# EAGLE board mmt_xbee (EAGLE 9.6.2)
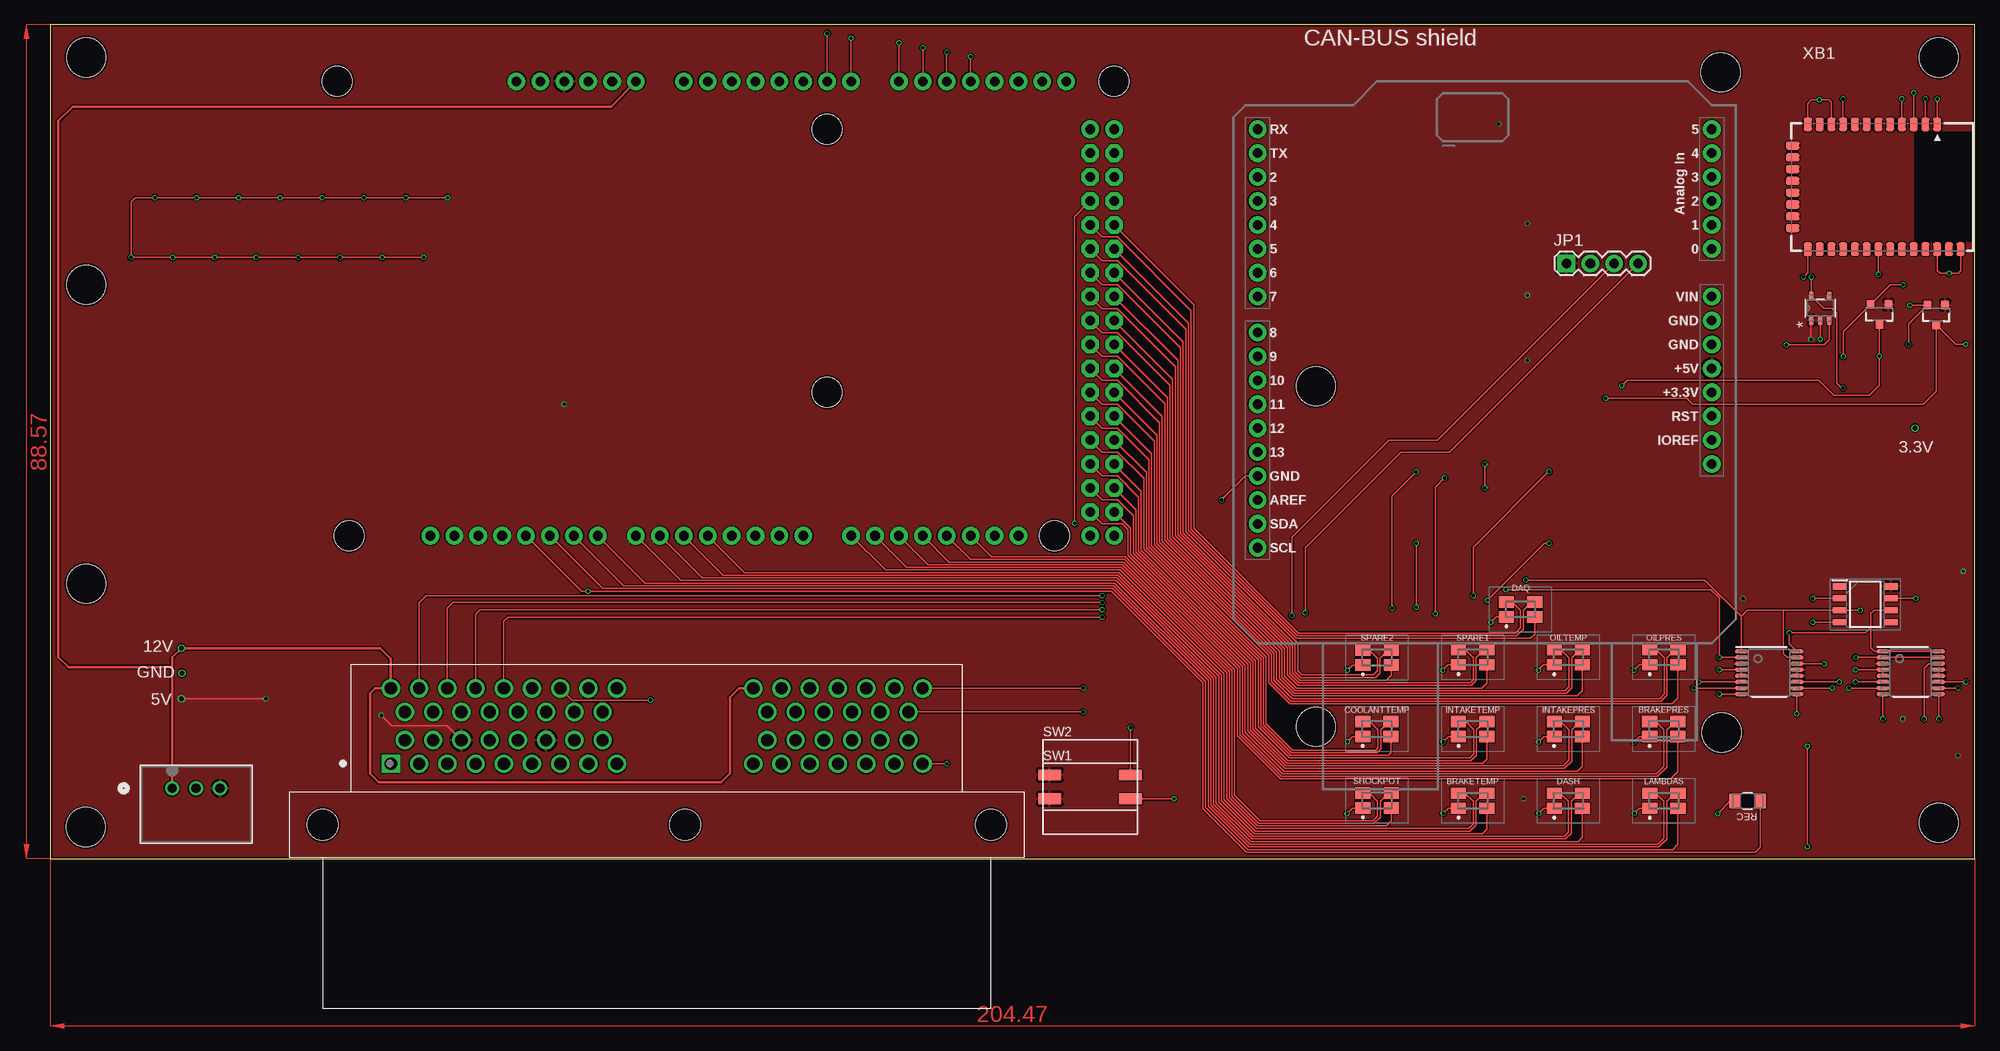
[diagram p7: board, top side]
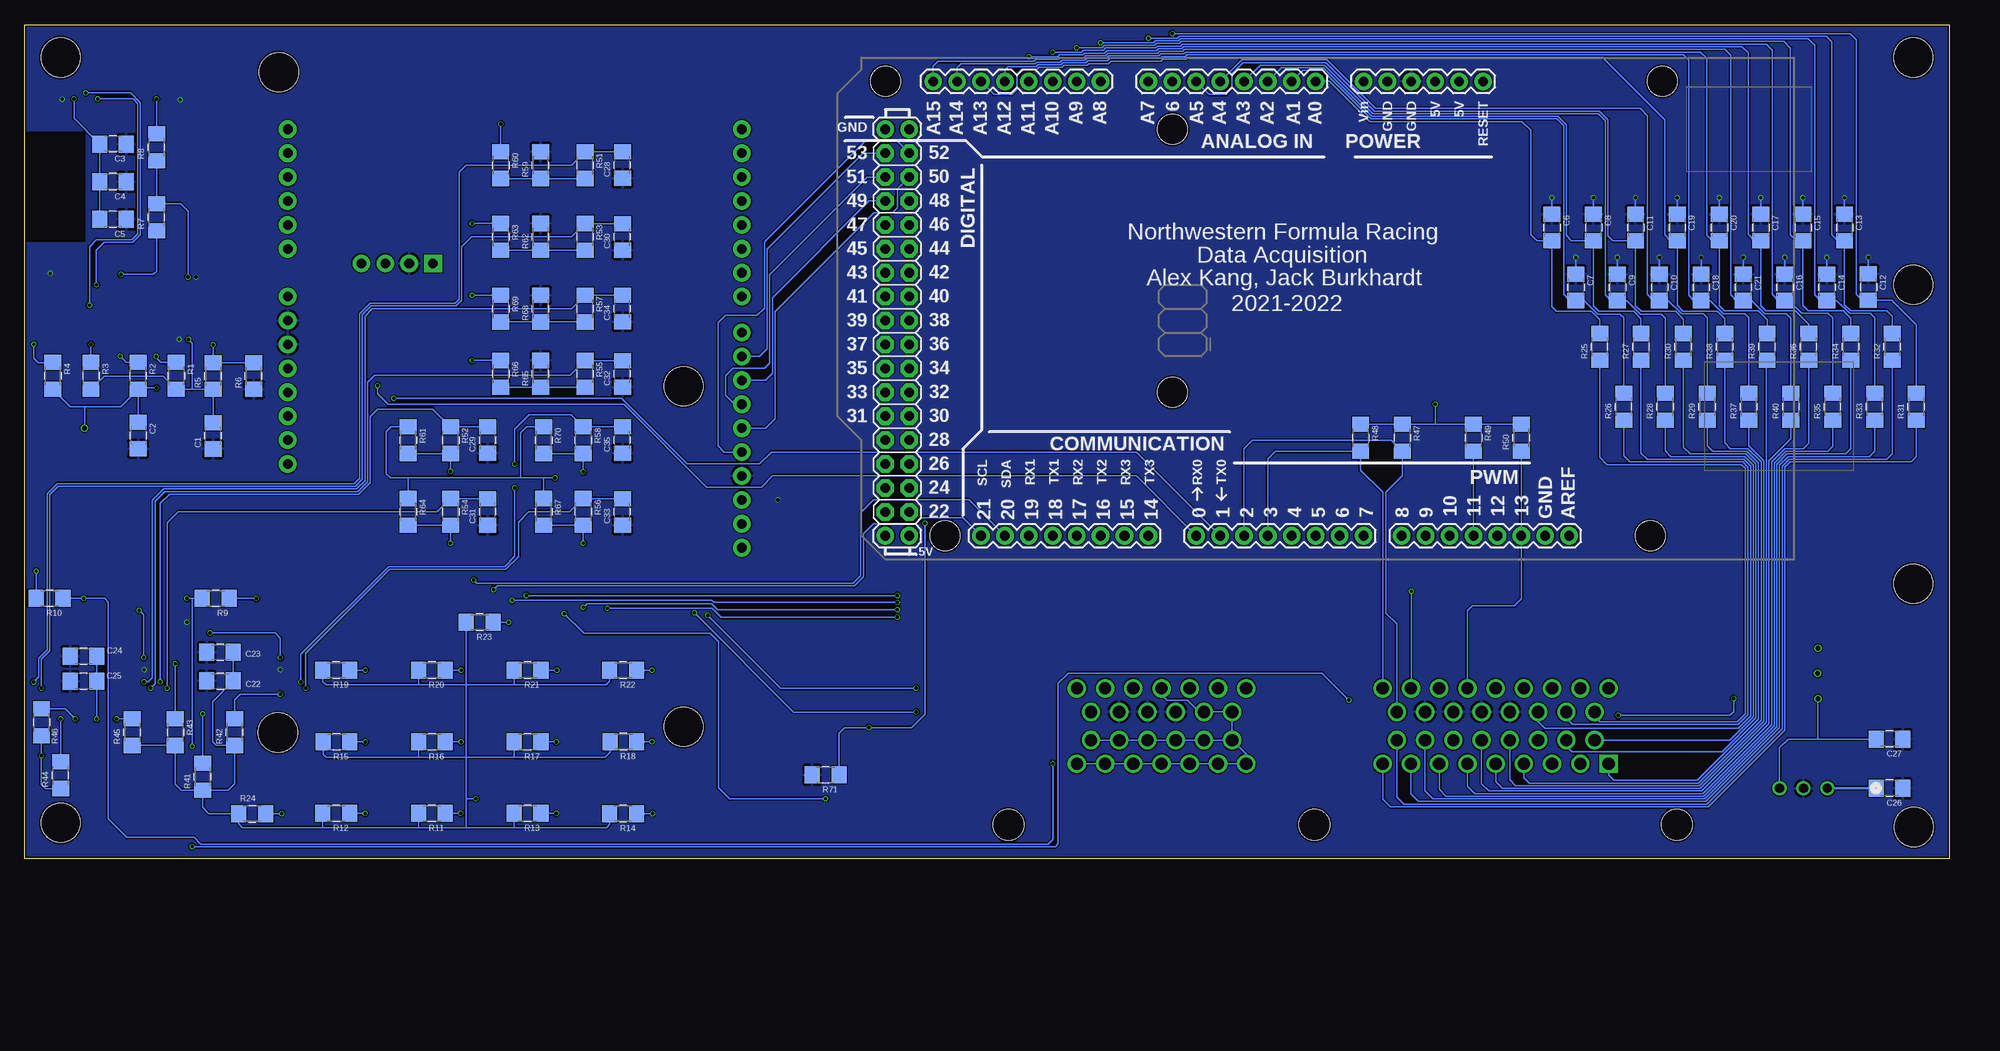
[diagram p8: board, bottom side, seen from below]

Size 204.45 x 88.57 mm. Coordinates in mm from the lower left corner, seen from the top.
Outline: 0,0 204.45,0 204.45,88.57 0,88.57 0,0
Copper layers (1*16): Top 0.035559375mm / dielectric 1.6mm / Bottom 0.035559375mm
Design rules "jlcpcb2layer": minimum track width 5mil, minimum drill 12mil, track to track 5mil, track to pad 5mil, pad to pad 5mil, via to via 5mil, smd to smd 5mil, copper to edge 8mil, drill to drill 6mil, minimum pad ring 5mil, minimum via ring 3mil, stop-mask expansion 2.5mil, vias tented up to drill 0mil, thermal gap 10mil
Holes 4.17 mm at 134.47,50.19 134.47,14.02 177.57,13.39 177.47,83.52 3.81,85.09 3.76,3.35 200.66,3.81 200.66,85.09 3.81,29.21 3.81,60.96
tRestrict: area 198.1,65.6 to 205,77.1
bRestrict: area 198.1,65.6 to 205,77.1

## Footprints (pad centres in the part's own frame; a part is rotated, then mirrored left to right if it is on the bottom)
ARDUINO_MEGA = drill 1.016 pad 1.88: 0 13.97,24.13; 1 11.43,24.13; 2 8.89,24.13; 3 6.35,24.13; 3.3V -13.97,-24.13; 4 3.81,24.13; 5 1.27,24.13; 5V@0 -11.43,-24.13; 5V@1 44.45,24.13; 5V@2 46.99,24.13; 6 -1.27,24.13; 7 -3.81,24.13; 8 -7.874,24.13; 9 -10.414,24.13; 10 -12.954,24.13; 11 -15.494,24.13; 12 -18.034,24.13; 13 -20.574,24.13; 14 19.05,24.13; 15 21.59,24.13; 16 24.13,24.13; 17 26.67,24.13; 18 29.21,24.13; 19 31.75,24.13; 20 34.29,24.13; 21 36.83,24.13; A0 1.27,-24.13; A1 3.81,-24.13; A2 6.35,-24.13; A3 8.89,-24.13; A4 11.43,-24.13; A5 13.97,-24.13; A6 16.51,-24.13; A7 19.05,-24.13; A8 24.13,-24.13; A9 26.67,-24.13; A10 29.21,-24.13; A11 31.75,-24.13; A12 34.29,-24.13; A13 36.83,-24.13; A14 39.37,-24.13; A15 41.91,-24.13; AREF -25.654,24.13; GND@0 -8.89,-24.13; GND@1 -6.35,-24.13; GND@2 44.45,-19.05; GND@3 46.99,-19.05; GND@4 -23.114,24.13; RESET -16.51,-24.13; VIN -3.81,-24.13 | drill 1.016 pad 1.88 octagon: 22 44.45,21.59; 23 46.99,21.59; 24 44.45,19.05; 25 46.99,19.05; 26 44.45,16.51; 27 46.99,16.51; 28 44.45,13.97; 29 46.99,13.97; 30 44.45,11.43; 31 46.99,11.43; 32 44.45,8.89; 33 46.99,8.89; 34 44.45,6.35; 35 46.99,6.35; 36 44.45,3.81; 37 46.99,3.81; 38 44.45,1.27; 39 46.99,1.27; 40 44.45,-1.27; 41 46.99,-1.27; 42 44.45,-3.81; 43 46.99,-3.81; 44 44.45,-6.35; 45 46.99,-6.35; 46 44.45,-8.89; 47 46.99,-8.89; 48 44.45,-11.43; 49 46.99,-11.43; 50 44.45,-13.97; 51 46.99,-13.97; 52 44.45,-16.51; 53 46.99,-16.51 | hole 3.2: -34.29,24.13; -35.56,-24.13; 16.51,8.89; 16.51,-19.05; 40.64,24.13; 46.99,-24.13
156120M173000 = smd 1.6 x 1.2: 1 -1.5,-0.8; 2 -1.5,0.8; 3 1.5,0.8; 4 1.5,-0.8
C1206 = smd 1.6 x 1.8: 1 -1.4,0; 2 1.4,0
SOIC127P600X175-8N = smd 1.525 x 0.65: 1 -2.712,1.905; 2 -2.712,0.635; 3 -2.712,-0.635; 4 -2.712,-1.905; 5 2.712,-1.905; 6 2.712,-0.635; 7 2.712,0.635; 8 2.712,1.905
TE_6473427-1 = drill 1.3 square: 1 -31.25,6.5 | drill 1.3: 2 -28.25,6.5; 3 -25.25,6.5; 4 -22.25,6.5; 5 -19.25,6.5; 6 -16.25,6.5; 7 -13.25,6.5; 8 -10.25,6.5; 9 -7.25,6.5; 10 -29.75,9; 11 -26.75,9; 12 -23.75,9; 13 -20.75,9; 14 -17.75,9; 15 -14.75,9; 16 -11.75,9; 17 -8.75,9; 18 -29.75,12; 19 -26.75,12; 20 -23.75,12; 21 -20.75,12; 22 -17.75,12; 23 -14.75,12; 24 -11.75,12; 25 -8.75,12; 26 -31.25,14.5; 27 -28.25,14.5; 28 -25.25,14.5; 29 -22.25,14.5; 30 -19.25,14.5; 31 -16.25,14.5; 32 -13.25,14.5; 33 -10.25,14.5; 34 -7.25,14.5; 35 7.25,6.5; 36 10.25,6.5; 37 13.25,6.5; 38 16.25,6.5; 39 19.25,6.5; 40 22.25,6.5; 41 25.25,6.5; 42 8.75,9; 43 11.75,9; 44 14.75,9; 45 17.75,9; 46 20.75,9; 47 23.75,9; 48 8.75,12; 49 11.75,12; 50 14.75,12; 51 17.75,12; 52 20.75,12; 53 23.75,12; 54 7.25,14.5; 55 10.25,14.5; 56 13.25,14.5; 57 16.25,14.5; 58 19.25,14.5; 59 22.25,14.5; 60 25.25,14.5 | hole 3.3: 0,0; -38.5,0; 32.5,0
CONN3_10S05_XPP = drill 0.991 pad 1.499: 1 0,0; 2 2.54,0; 3 5.08,0
1X04 = drill 1.016 pad 1.88 square: 1 0,0 | drill 1.016 pad 1.88: 2 2.54,0; 3 5.08,0; 4 7.62,0
SOT23-3 = smd 0.8 x 0.9: 1 -0.95,-1; 2 0.95,-1; 3 0,1.1
R1206 = smd 1.6 x 1.803: 1 -1.422,0; 2 1.422,0
LED_SML-LX1206SIC-TR_LUM = smd 1.168 x 1.499: 1 -1.372,0; 2 1.372,0
CTS_ELECTROCOMPONENTS_204-211ST_0 = smd 2.44 x 1.13: 1 -4.3,0; 2 4.3,0
SOT-25_TOR = smd 0.927 x 0.432: 1 -1.289,0.95; 2 -1.289,0; 3 -1.289,-0.95; 4 1.289,-0.95; 5 1.289,0.95
UNO_R3_SHIELD = drill 1.016 pad 1.88: 3.3V 50.8,26.67; 5V 50.8,29.21; A0 50.8,41.91; A1 50.8,44.45; A2 50.8,46.99; A3 50.8,49.53; A4 50.8,52.07; A5 50.8,54.61; AREF 2.54,15.24; D2 2.54,49.53; D3 2.54,46.99; D4 2.54,44.45; D5 2.54,41.91; D6 2.54,39.37; D7 2.54,36.83; D8 2.54,33.02; D9 2.54,30.48; D10 2.54,27.94; D11 2.54,25.4; D12 2.54,22.86; D13 2.54,20.32; GND@0 50.8,31.75; GND@1 50.8,34.29; GND@2 2.54,17.78; IOREF 50.8,21.59; NC 50.8,19.05; RES 50.8,24.13; RX 2.54,54.61; SCL 2.54,10.16; SDA 2.54,12.7; TX 2.54,52.07; VIN 50.8,36.83
PW0016A_N = smd 1.4 x 0.45: 1 -2.95,2.275; 2 -2.95,1.625; 3 -2.95,0.975; 4 -2.95,0.325; 5 -2.95,-0.325; 6 -2.95,-0.975; 7 -2.95,-1.625; 8 -2.95,-2.275; 9 2.95,-2.275; 10 2.95,-1.625; 11 2.95,-0.975; 12 2.95,-0.325; 13 2.95,0.325; 14 2.95,0.975; 15 2.95,1.625; 16 2.95,2.275
XBEE_MMT = smd 1.43 x 0.85: 1 0,0; 2 0,-1.25; 3 0,-2.5; 4 0,-3.75; 5 0,-5; 6 0,-6.25; 7 0,-7.5; 8 0,-8.75; 9 0,-10; 10 0,-11.25; 11 0,-12.5; 12 0,-13.75; 21 13.25,-13.75; 22 13.25,-12.5; 23 13.25,-11.25; 24 13.25,-10; 25 13.25,-8.75; 26 13.25,-7.5; 27 13.25,-6.25; 28 13.25,-5; 29 13.25,-3.75; 30 13.25,-2.5; 31 13.25,-1.25; 32 13.25,0; 33 13.25,1.25; 34 13.25,2.5 | smd 0.85 x 1.43: 13 2.25,-15.35; 14 3.5,-15.35; 15 4.75,-15.35; 16 6,-15.35; 17 7.25,-15.35; 18 8.5,-15.35; 19 9.75,-15.35; 20 11,-15.35

## Placement (x,y rotation side)
B1  ARDUINO_MEGA_R3FULL  [ARDUINO_MEGA]  66.04,58.42 180 bottom
BRAKEPRES  156120M173000  [156120M173000]  171.42,13.77 0 top
BRAKETEMP  156120M173000  [156120M173000]  151.13,6.15 0 top
C1  10μF  [C1206]  184.45,44.91 90 bottom
C2  10μF  [C1206]  192.43,44.93 270 bottom
C3  8.2pF  [C1206]  195.1,75.9 180 bottom
C4  8.2pF  [C1206]  195.1,71.88 180 bottom
C5  10μF  [C1206]  195.1,67.89 180 bottom
C6  0.1μF  [C1206]  42.21,67.03 270 bottom
C7  0.1μF  [C1206]  39.67,60.68 270 bottom
C8  0.1μF  [C1206]  37.8,67.03 270 bottom
C9  0.1μF  [C1206]  35.26,60.68 270 bottom
C10  0.1μF  [C1206]  30.78,60.68 270 bottom
C11  0.1μF  [C1206]  33.32,67.03 270 bottom
C12  0.1μF  [C1206]  8.59,60.71 270 bottom
C13  0.1μF  [C1206]  11.13,67.03 270 bottom
C14  0.1μF  [C1206]  13,60.68 270 bottom
C15  0.1μF  [C1206]  15.54,67.03 270 bottom
C16  0.1μF  [C1206]  17.48,60.68 270 bottom
C17  0.1μF  [C1206]  20.02,67.03 270 bottom
C18  0.1μF  [C1206]  26.37,60.68 270 bottom
C19  0.1μF  [C1206]  28.91,67.03 270 bottom
C20  0.1μF  [C1206]  24.43,67.03 270 bottom
C21  0.1μF  [C1206]  21.89,60.68 270 bottom
C22  0.1μF  [C1206]  183.72,18.87 0 bottom
C23  0.1μF  [C1206]  183.72,21.89 180 bottom
C24  0.1μF  [C1206]  198.22,21.51 0 bottom
C25  0.1μF  [C1206]  198.22,18.82 180 bottom
C26  10μF  [C1206]  6.35,7.47 180 bottom
C27  22μF  [C1206]  6.35,12.7 180 bottom
C28  0.1μF  [C1206]  140.97,73.66 90 bottom
C29  0.1μF  [C1206]  155.27,44.45 90 bottom
C30  0.1μF  [C1206]  140.97,66.04 90 bottom
C31  0.1μF  [C1206]  155.27,36.83 90 bottom
C32  0.1μF  [C1206]  140.97,51.49 90 bottom
C33  0.1μF  [C1206]  140.97,36.83 90 bottom
C34  0.1μF  [C1206]  140.97,58.42 90 bottom
C35  0.1μF  [C1206]  140.97,44.45 90 bottom
COOLANTTEMP  156120M173000  [156120M173000]  140.94,13.77 0 top
DAQ  156120M173000  [156120M173000]  156.21,26.47 0 top
DASH  156120M173000  [156120M173000]  161.29,6.15 0 top
IC1  P82B715D  [SOIC127P600X175-8N]  192.84,27 0 top
INTAKEPRES  156120M173000  [156120M173000]  161.29,13.77 0 top
INTAKETEMP  156120M173000  [156120M173000]  151.13,13.77 0 top
J1  6473427-1  [TE_6473427-1]  67.44,3.58 0 top
J2  VR10S05  [CONN3_10S05_XPP]  12.95,7.47 0 top
JP1  DNP  [1X04]  161.09,63.22 0 top
LAMBDAS  156120M173000  [156120M173000]  171.45,6.15 0 top
OILPRES  156120M173000  [156120M173000]  171.45,21.39 0 top
OILTEMP  156120M173000  [156120M173000]  161.29,21.39 0 top
Q1  MOSFET-NCHANNELSMD  [SOT23-3]  200.38,57.78 180 top
Q2  MOSFET-NCHANNELSMD  [SOT23-3]  194.34,57.84 180 top
R1  1kΩ  [R1206]  188.37,51.28 270 bottom
R2  1kΩ  [R1206]  192.43,51.28 270 bottom
R3  1kΩ  [R1206]  197.43,51.28 270 bottom
R4  1kΩ  [R1206]  201.5,51.28 270 bottom
R5  10kΩ  [R1206]  184.45,51.26 90 bottom
R6  10kΩ  [R1206]  180.14,51.26 90 bottom
R7  10kΩ  [R1206]  190.47,68.12 90 bottom
R8  10kΩ  [R1206]  190.47,75.56 90 bottom
R9  10kΩ  [R1206]  184.18,27.64 180 bottom
R10  10kΩ  [R1206]  201.83,27.64 180 bottom
R11  1kΩ  [R1206]  161.21,4.8 180 bottom
R12  1kΩ  [R1206]  171.37,4.8 180 bottom
R13  1kΩ  [R1206]  151.05,4.8 180 bottom
R14  1kΩ  [R1206]  140.89,4.78 180 bottom
R15  1kΩ  [R1206]  171.35,12.4 180 bottom
R16  1kΩ  [R1206]  161.21,12.4 180 bottom
R17  1kΩ  [R1206]  151.05,12.4 180 bottom
R18  1kΩ  [R1206]  140.87,12.42 180 bottom
R19  1kΩ  [R1206]  171.37,20.02 180 bottom
R20  1kΩ  [R1206]  161.21,20.02 180 bottom
R21  1kΩ  [R1206]  151.05,20.02 180 bottom
R22  1kΩ  [R1206]  140.89,20.02 180 bottom
R23  1kΩ  [R1206]  156.13,25.1 180 bottom
R24  1kΩ  [R1206]  180.31,4.78 0 bottom
R25  10kΩ  [R1206]  37.13,54.36 90 bottom
R26  10kΩ  [R1206]  34.59,48.01 90 bottom
R27  10kΩ  [R1206]  32.74,54.36 90 bottom
R28  10kΩ  [R1206]  30.18,48.01 90 bottom
R29  10kΩ  [R1206]  25.7,48.01 90 bottom
R30  10kΩ  [R1206]  28.24,54.36 90 bottom
R31  10kΩ  [R1206]  3.51,48.01 90 bottom
R32  10kΩ  [R1206]  6.05,54.36 90 bottom
R33  10kΩ  [R1206]  7.92,48.01 90 bottom
R34  10kΩ  [R1206]  10.46,54.36 90 bottom
R35  10kΩ  [R1206]  12.4,48.01 90 bottom
R36  10kΩ  [R1206]  14.94,54.36 90 bottom
R37  10kΩ  [R1206]  21.29,48.01 90 bottom
R38  10kΩ  [R1206]  23.85,54.36 90 bottom
R39  10kΩ  [R1206]  19.35,54.36 90 bottom
R40  10kΩ  [R1206]  16.81,48.01 90 bottom
R41  10kΩ  [R1206]  185.57,8.69 90 bottom
R42  10kΩ  [R1206]  182.17,13.44 90 bottom
R43  10kΩ  [R1206]  188.47,13.44 270 bottom
R44  10kΩ  [R1206]  200.66,8.86 90 bottom
R45  10kΩ  [R1206]  193.04,13.44 90 bottom
R46  10kΩ  [R1206]  202.69,14.48 270 bottom
R47  10kΩ  [R1206]  58.12,44.7 270 bottom
R48  10kΩ  [R1206]  62.53,44.7 270 bottom
R49  10kΩ  [R1206]  50.55,44.7 270 bottom
R50  10kΩ  [R1206]  45.47,44.7 90 bottom
R51  10kΩ  [R1206]  144.96,73.66 270 bottom
R52  10kΩ  [R1206]  159.23,44.45 270 bottom
R53  10kΩ  [R1206]  144.96,66.04 270 bottom
R54  10kΩ  [R1206]  159.23,36.83 270 bottom
R55  10kΩ  [R1206]  144.96,51.49 270 bottom
R56  10kΩ  [R1206]  145.14,36.83 270 bottom
R57  10kΩ  [R1206]  144.96,58.42 270 bottom
R58  10kΩ  [R1206]  145.14,44.45 270 bottom
R59  350Ω  [R1206]  149.66,73.66 90 bottom
R60  350Ω  [R1206]  153.9,73.66 270 bottom
R61  350Ω  [R1206]  163.73,44.45 270 bottom
R62  350Ω  [R1206]  149.66,66.04 90 bottom
R63  350Ω  [R1206]  153.9,66.04 270 bottom
R64  350Ω  [R1206]  163.73,36.83 270 bottom
R65  350Ω  [R1206]  149.66,51.49 90 bottom
R66  350Ω  [R1206]  153.9,51.49 270 bottom
R67  350Ω  [R1206]  149.35,36.83 270 bottom
R68  350Ω  [R1206]  149.66,58.42 90 bottom
R69  350Ω  [R1206]  153.9,58.42 270 bottom
R70  350Ω  [R1206]  149.35,44.45 270 bottom
R71  10kΩ  [R1206]  119.38,8.89 180 bottom
REC  SML-LX1206SIC-TR  [LED_SML-LX1206SIC-TR_LUM]  180.34,6.12 180 top
SHOCKPOT  156120M173000  [156120M173000]  140.97,6.17 0 top
SPARE1  156120M173000  [156120M173000]  151.13,21.39 0 top
SPARE2  156120M173000  [156120M173000]  140.97,21.36 0 top
SW1  CTS_ELECTROCOMPONENTS_204-211STCTS_ELECTROCOMPONENTS_204-211ST_0_0  [CTS_ELECTROCOMPONENTS_204-211ST_0]  110.49,6.35 0 top
SW2  CTS_ELECTROCOMPONENTS_204-211STCTS_ELECTROCOMPONENTS_204-211ST_0_0  [CTS_ELECTROCOMPONENTS_204-211ST_0]  110.49,8.89 0 top
U1  XC6220B331MR-G  [SOT-25_TOR]  188.06,58.47 90 top
U4  ARDUINO_R3_SHIELD  [UNO_R3_SHIELD]  125.73,22.86 0 top
U6  ADS1119IPWT  [PW0016A_N]  182.63,19.74 0 top
U7  ADS1119IPWT  [PW0016A_N]  197.66,19.74 0 top
XB1  XBEE_MMT  [XBEE_MMT]  200.48,77.98 270 top

## Tracks (layer width: path | path; a pad name or v marks a point on that pad's centre or on a via)
2AIC0  (via drill 0.35)
  Top 0.152: U7.11 203.51,18.76 v203.53,18.74
  Bottom 0.152: v203.53,18.74 202.97,19.3 202.97,21.3 202.08,22.19 202.08,38.75 201,39.83 169.45,39.83 168.88,40.39 168.88,57.86 167.77,58.98 158.74,58.98 158.32,59.4 158.32,72.92 157.58,73.66 146.38,73.66 R51.1 144.94,75.06 C28.2
2AIC1  (via drill 0.35)
  Top 0.152: v190.07,18.77 185.59,18.77 U6.11
  Bottom 0.152: C29.2 159.21,45.85 R52.1 161.11,47.75 166.95,47.75 167.77,46.94 167.77,39.93 168.99,38.71 189.09,38.71 190.07,37.73 v190.07,18.77
2AIC2  (via drill 0.35)
  Top 0.152: U7.10 v202.69,18.11
  Bottom 0.152: v202.69,18.11 202.69,21.18 201.8,22.07 201.8,38.63 200.89,39.55 169.33,39.55 168.6,40.28 168.6,57.75 167.65,58.7 158.62,58.7 158.04,59.28 158.04,65 157,66.04 146.38,66.04 R53.1 144.94,67.44 C30.2
2AIC3  (via drill 0.35)
  Top 0.152: v189.33,18.11 U6.10
  Bottom 0.152: C31.2 159.21,38.23 R54.1 160.66,36.83 188.16,36.83 189.33,35.66 v189.33,18.11
3.3V  (via drill 0.35, 0.51)
  Top 0.152: v187.12,61.77 v187.11,61.76 U1.5 188.43,58.44 189.28,58.44 189.79,57.94 189.79,50.47 190.27,49.99 v190.47,49.99
  Bottom 0.152: v187.12,61.77 187.12,68.78 187.88,69.55 R7.2 R8.1 | R2.2 C2.1 | R2.2 194.28,48.01 198.12,48.01 | R4.2 199.64,48.01 198.12,48.01 | v190.47,49.99 192.3,49.99 R2.2 | 198.12,48.01 v198.12,45.72
3AIC0  (via drill 0.35)
  Top 0.152: U7.7 v191.11,18.11
  Bottom 0.152: v191.11,18.11 190.63,18.59 190.63,37.97 189.61,38.99 169.1,38.99 168.05,40.05 168.05,50.6 167.28,51.36 146.51,51.36 R55.1 144.94,52.89 C32.2
3AIC1  (via drill 0.35)
  Top 0.152: v174.6,18.11 U6.7
  Bottom 0.152: C33.2 145.11,38.23 R56.1 146.56,36.83 150.93,36.83 152.02,35.74 152.02,32.08 153.39,30.71 165.71,30.71 174.6,21.82 v174.6,18.11
3AIC2  (via drill 0.35)
  Top 0.152: U7.6 v191.81,18.76 v191.79,18.77
  Bottom 0.152: v191.79,18.77 191.34,18.77 190.92,19.19 190.92,38.07 189.73,39.27 169.22,39.27 168.33,40.16 168.33,57.63 167.54,58.42 146.38,58.42 R57.1 144.94,59.82 C34.2
3AIC3  (via drill 0.35)
  Top 0.152: U6.6 v175.13,18.76 | v152.4,39.37 v152.4,41.91
  Bottom 0.152: C35.2 145.11,45.85 R58.1 146.41,47.14 150.88,47.14 152.4,45.62 v152.4,41.91 | v175.13,18.76 175.13,21.68 165.82,30.99 153.51,30.99 152.4,32.09 v152.4,39.37
4
  Top 0.152: BRAKETEMP.4 152.63,3.13 152.15,2.64 127.92,2.64 124.44,6.13 124.44,19.5 113.55,30.38 73.76,30.38 B1.4
5
  Top 0.152: B1.5 71.5,30.1 113.44,30.1 124.16,19.38 124.16,6.01 127.8,2.36 160.86,2.36 161.31,2.82 161.31,6.07 160.44,6.95 DASH.2
5V  (via drill 0.35, 0.51)
  Top 0.152: J1.12 42.17,14.1 36.3,14.1 v35.18,15.22 | v13.95,16.99 v22.91,16.99 | U1.1 187.07,57.14 v187.07,55.14
  Bottom 0.152: 172.8,3.3 R12.2 | 152.48,3.3 157.56,3.3 | 162.64,3.3 157.56,3.3 | R11.2 162.64,3.3 | 162.64,3.3 | R13.2 152.48,3.3 | 152.48,3.3 | R18.2 142.29,11.3 142.82,10.77 152.48,10.77 | R15.2 172.77,11.1 172.44,10.77 162.64,10.77 | 162.64,10.77 157.56,10.77 | 152.48,10.77 157.56,10.77 | R17.2 152.48,10.77 | 152.48,10.77 | R16.2 162.64,10.77 | 162.64,10.77 | R22.2 142.32,18.82 142.7,18.44 152.48,18.44 | 152.48,18.44 157.56,18.44 | 157.56,18.44 162.64,18.44 | 162.64,18.44 172.44,18.44 172.8,18.8 R19.2 | R21.2 152.48,18.44 | R20.2 162.64,18.44 | R23.2 157.56,18.44 | 157.56,18.44 | 157.56,18.44 157.56,10.77 | 157.56,10.77 | 157.56,10.77 157.56,6.35 | 157.56,6.35 157.56,3.3 | 157.56,3.3 | 157.56,6.35 v156.54,6.35 | R14.2 142.32,3.63 142.65,3.3 152.48,3.3 | 162.64,3.3 172.8,3.3 | 172.8,3.3 181.35,3.3 181.74,3.68 R24.1 184.91,4.77 185.57,5.44 R41.1 | 172.8,3.3 | C27.2 13.95,12.7 | 13.95,12.7 17.12,12.7 18.03,11.79 J2.3 | v13.95,16.99 13.95,12.7 | R41.1 187.83,7.26 188.47,7.9 R43.2 R45.1 | R41.1 182.83,7.26 182.17,7.92 R42.1 184.12,12.02 184.51,12.39 184.51,16.69 C22.2 C23.1 | R44.1 202.26,7.44 202.69,7.87 v202.69,10.95 R46.2 | C24.2 C25.1 v196.82,14.84 v196.82,14.83 | R66.1 v156.95,52.91 | R69.1 v156.95,59.84 | R63.1 v156.95,67.46 | R60.1 v153.9,78.03 | R9.1 v179.86,27.63 | R10.2 v203.25,30.53 | R50.2 R49.1 54.61,46.13 | 54.61,46.13 R47.1 R48.1 | 54.61,46.13 v54.61,48.26 | v22.91,16.99 22.91,15.6 23.29,15.22 v35.18,15.22 | C1.2 R5.1 186.69,49.83 | 186.69,49.83 188.34,49.83 R1.2 189.76,51.26 196.04,51.26 R3.2 | 186.69,49.83 186.69,54.76 v187.07,55.14
  pour Top (rank 6): 0,88.9 204.47,88.9 204.47,0 0,0
5VOR0V  (via drill 0.35)
  Top 0.152: SW1.2 v119.38,6.35 | v147.14,26.01 147.14,39.45 v148.13,40.44
  Bottom 0.152: v119.38,6.35 129.59,6.35 130.76,7.52 130.76,23.04 131.65,23.93 145.06,23.93 v147.14,26.01 | v148.13,40.44 149.35,40.44 | 149.35,40.44 151.79,40.44 | R70.1 151.16,45.87 151.79,45.24 151.79,40.44 | 163.73,40.44 R64.1 | R61.1 165.56,45.87 166.06,45.36 166.06,40.89 165.61,40.44 163.73,40.44 | 151.79,40.44 163.73,40.44 | R67.1 149.35,40.44
6
  Top 0.152: B1.6 69.24,29.82 113.32,29.82 123.88,19.27 123.88,5.89 127.69,2.08 160.97,2.08 161.59,2.7 161.59,6.07 162.47,6.95 DASH.3
7
  Top 0.152: B1.7 66.98,29.54 113.21,29.54 123.6,19.15 123.6,5.78 127.57,1.8 162.33,1.8 162.79,2.26 DASH.4
8
  Top 0.152: B1.8 63.2,29.26 113.09,29.26 123.32,19.04 123.32,5.66 127.46,1.52 170.81,1.52 171.45,2.16 171.45,6.07 170.57,6.95 LAMBDAS.2
9
  Top 0.152: B1.9 60.94,28.98 112.98,28.98 123.04,18.92 123.04,5.55 127.34,1.24 170.93,1.24 171.73,2.04 171.73,6.07 172.61,6.95 LAMBDAS.3
10
  Top 0.152: B1.10 58.67,28.7 112.86,28.7 122.76,18.8 122.76,5.43 127.22,0.96 172.39,0.96 172.95,1.52 LAMBDAS.4
12V  (via drill 0.51)
  Top 0.254: 12.95,20.32 12.95,21.36 v13.95,22.35 35.05,22.35 36.19,21.22 J1.26 34.52,18.08 34.01,17.58 34.01,8.99 34.87,8.13 71.27,8.13 72.21,9.07 72.21,17.12 73.17,18.08 J1.54 | 12.95,20.32 1.96,20.32 0.86,21.41 0.86,78.36 2.39,79.88 59.56,79.88 B1.VIN | J2.1 12.95,20.32
  Bottom 0.254: C26.2 J2.1
14
  Top 0.152: B1.14 88.72,30.66 113.67,30.66 124.71,19.61 124.71,6.24 128.04,2.92 150.81,2.92 151.46,3.57 151.46,6.07 152.34,6.95 BRAKETEMP.3
15
  Top 0.152: B1.15 90.98,30.94 113.79,30.94 124.99,19.73 124.99,6.36 128.15,3.2 150.7,3.2 151.18,3.68 151.18,6.07 150.31,6.95 BRAKETEMP.2
16
  Top 0.152: B1.16 93.24,31.22 113.9,31.22 125.27,19.85 125.27,6.47 128.27,3.48 141.94,3.48 142.47,4.01 SHOCKPOT.4
17
  Top 0.152: B1.17 95.5,31.5 114.02,31.5 125.55,19.96 125.55,6.59 128.38,3.76 140.65,3.76 141.3,4.4 141.3,6.1 142.18,6.97 SHOCKPOT.3
18
  Top 0.152: B1.18 97.77,31.77 114.13,31.77 125.83,20.08 125.83,6.71 128.5,4.04 140.54,4.04 141.02,4.52 141.02,6.1 140.15,6.97 SHOCKPOT.2
19
  Top 0.152: B1.19 100.03,32.05 114.25,32.05 126.11,20.19 126.11,13.06 130.71,8.46 172.16,8.46 172.93,9.22 BRAKEPRES.4
22
  Top 0.152: BRAKEPRES.3 172.61,14.57 171.73,13.69 171.73,9.7 170.76,8.74 130.82,8.74 126.39,13.17 126.39,20.31 114.5,32.2 114.5,34.95 113.89,35.56 111.76,35.56 B1.22
23
  Top 0.152: BRAKEPRES.2 170.57,14.57 171.45,13.69 171.45,9.82 170.65,9.02 130.94,9.02 126.67,13.29 126.67,20.42 114.78,32.31 114.78,35.08 B1.23
24
  Top 0.152: INTAKEPRES.4 162.79,9.83 162.25,9.3 131.06,9.3 126.95,13.4 126.95,20.54 115.06,32.43 115.06,36.41 113.38,38.1 111.76,38.1 B1.24
25
  Top 0.152: INTAKEPRES.3 162.55,14.57 161.65,13.66 161.65,10.34 160.88,9.58 131.17,9.58 127.23,13.52 127.23,20.66 115.34,32.54 115.34,37.06 B1.25
26
  Top 0.152: INTAKEPRES.2 160.47,14.57 161.37,13.66 161.37,10.45 160.77,9.85 131.29,9.85 127.51,13.63 127.51,20.77 115.62,32.66 115.62,38.4 113.38,40.64 111.76,40.64 B1.26
27
  Top 0.152: INTAKETEMP.4 152.63,10.57 152.2,10.13 131.4,10.13 127.79,13.75 127.79,20.89 115.9,32.77 115.9,39.04 B1.27
28
  Top 0.152: INTAKETEMP.3 152.41,14.57 151.54,13.69 151.54,11 150.95,10.41 131.52,10.41 128.07,13.87 128.07,21 116.18,32.89 116.18,40.38 113.38,43.18 111.76,43.18 B1.28
29
  Top 0.152: INTAKETEMP.2 150.38,14.57 151.26,13.69 151.26,11.11 150.84,10.69 131.63,10.69 128.35,13.98 128.35,21.12 116.46,33.01 116.46,41.02 B1.29
30
  Top 0.152: COOLANTTEMP.4 142.44,11.25 142.16,10.97 131.75,10.97 128.63,14.1 128.63,20.19 128.63,20.31 128.63,21.23 116.74,33.12 116.74,42.36 113.38,45.72 111.76,45.72 B1.30
31
  Top 0.152: COOLANTTEMP.3 142.23,14.57 141.35,13.69 141.35,11.66 140.94,11.25 131.87,11.25 128.91,14.21 128.91,21.35 117.02,33.24 117.02,43 B1.31
32
  Top 0.152: COOLANTTEMP.2 140.19,14.57 141.07,13.69 141.07,11.77 140.83,11.53 131.98,11.53 129.18,14.33 129.18,21.47 117.3,33.35 117.3,44.34 113.38,48.26 111.76,48.26 B1.32
33
  Top 0.152: OILPRES.4 172.95,17.05 172.34,16.43 131.72,16.43 129.46,18.69 129.46,21.58 117.58,33.47 117.58,44.98 B1.33
34
  Top 0.152: OILPRES.3 172.63,22.19 171.78,21.34 171.78,17.37 171.12,16.71 131.84,16.71 129.74,18.81 129.74,21.7 117.86,33.58 117.86,46.32 113.38,50.8 111.76,50.8 B1.34
35
  Top 0.152: OILPRES.2 170.65,22.19 171.5,21.34 171.5,17.49 171,16.99 131.96,16.99 130.02,18.93 130.02,21.81 118.14,33.7 118.14,46.97 B1.35
36
  Top 0.152: OILTEMP.4 162.79,17.81 162.25,17.27 132.07,17.27 130.3,19.04 130.3,21.93 118.41,33.82 118.41,48.3 113.38,53.34 111.76,53.34 B1.36
37
  Top 0.152: OILTEMP.3 162.52,22.19 161.65,21.31 161.65,18.14 161.06,17.55 132.19,17.55 130.58,19.16 130.58,22.05 118.69,33.93 118.69,48.95 B1.37
38
  Top 0.152: OILTEMP.2 160.49,22.19 161.37,21.31 161.37,18.28 160.92,17.83 132.3,17.83 130.86,19.27 130.86,22.16 118.97,34.05 118.97,50.28 113.38,55.88 111.76,55.88 B1.38
39
  Top 0.152: SPARE1.4 152.63,18.62 152.12,18.11 132.42,18.11 131.14,19.39 131.14,22.28 119.25,34.16 119.25,50.93 B1.39
40
  Top 0.152: SPARE1.3 152.36,22.19 151.49,21.31 151.49,18.87 151,18.39 132.53,18.39 131.42,19.5 131.42,22.39 119.53,34.28 119.53,52.26 113.38,58.42 111.76,58.42 B1.40
41
  Top 0.152: SPARE1.2 150.33,22.19 151.21,21.31 151.21,19.01 150.86,18.67 132.65,18.67 131.7,19.62 131.7,22.51 119.81,34.39 119.81,52.91 B1.41
42
  Top 0.152: SPARE2.4 142.47,19.48 141.94,18.95 132.77,18.95 131.98,19.74 131.98,22.62 120.09,34.51 120.09,54.24 113.38,60.96 111.76,60.96 B1.42
43
  Top 0.152: SPARE2.3 142.15,22.16 141.28,21.28 141.28,19.71 140.79,19.23 132.88,19.23 132.26,19.85 132.26,22.74 120.37,34.63 120.37,54.89 B1.43
44
  Top 0.152: SPARE2.2 140.12,22.16 141,21.28 141,19.94 140.56,19.51 133,19.51 132.54,19.97 132.54,22.85 120.65,34.74 120.65,56.23 113.38,63.5 111.76,63.5 B1.44
45
  Top 0.152: DAQ.4 157.71,23.85 157.25,23.39 132.39,23.39 120.93,34.86 120.93,56.87 B1.45
46
  Top 0.152: DAQ.3 157.39,27.27 156.49,26.36 156.49,24.38 155.78,23.67 132.51,23.67 121.21,34.97 121.21,58.21 113.38,66.04 111.76,66.04 B1.46
47
  Top 0.152: DAQ.2 155.31,27.27 156.21,26.36 156.21,24.5 155.66,23.95 132.62,23.95 121.49,35.09 121.49,58.85 B1.47
48  (via drill 0.35)
  Top 0.152: v114.78,13.92 SW2.2 | B1.48 108.84,68.2 v108.84,35.61
  Bottom 0.152: R71.1 117.96,13.31 117.35,13.92 v114.78,13.92 110.26,13.92 108.84,15.34 v108.84,35.61
A0
  Bottom 0.152: R25.2 37.13,57.25 38,58.11 41.73,58.11 42.22,58.6 C6.2 43.81,65.63 44.45,66.27 44.45,77.34 45.39,78.28 61.57,78.28 65.84,82.55 B1.A0
A0IN
  Bottom 0.152: R25.1 37.13,52.07 37.13,42.62 36.37,41.86 22.07,41.86 21.67,41.45 21.67,15.4 22.54,14.53 37.11,14.53 37.69,15.11 J1.18
A1
  Bottom 0.152: R26.2 34.59,57.45 34.98,57.84 37.33,57.84 38.77,59.28 C7.2 40.33,59.28 40.97,59.92 40.97,77.84 41.69,78.56 61.44,78.56 66.6,83.72 68.68,83.72 B1.A1
A1IN
  Bottom 0.152: R26.1 34.59,42.77 33.96,42.14 21.95,42.14 21.39,41.57 21.39,15.28 22.42,14.25 40.04,14.25 40.69,14.9 J1.19
A2
  Bottom 0.152: R27.2 32.74,57.35 33.51,58.11 37.21,58.11 37.8,58.7 C8.2 40.13,65.63 40.69,66.19 40.69,77.95 41.58,78.84 61.33,78.84 66.48,84 70.93,84 B1.A2
A2IN
  Bottom 0.152: R27.1 32.74,43.08 32.08,42.42 21.84,42.42 21.11,41.69 21.11,15.17 22.41,13.87 42.97,13.87 43.69,14.59 J1.20
A3
  Bottom 0.152: R28.2 30.17,57.4 30.61,57.84 32.83,57.84 34.28,59.28 C9.2 35.94,59.28 36.55,59.89 36.55,78.38 37.3,79.12 61.21,79.12 66.37,84.28 73.2,84.28 B1.A3
A3IN
  Bottom 0.152: R28.1 30.17,43.31 29.57,42.7 21.72,42.7 20.83,41.8 20.83,15.05 23.3,12.58 J1.10
A4
  Bottom 0.152: R29.2 25.7,57.43 26.14,57.86 28.41,57.86 29.83,59.28 C10.2 31.42,59.28 32.05,59.92 32.05,78.92 32.82,79.68 60.98,79.68 66.14,84.84 75.15,84.84 77.43,82.55 B1.A4
A4IN
  Bottom 0.152: R29.1 25.7,43.87 25.09,43.26 21.49,43.26 20.27,42.03 20.27,14.82 26.78,8.31 35.64,8.31 36.19,8.86 J1.1
A5
  Bottom 0.152: R30.2 28.25,57.3 29.06,58.11 32.72,58.11 33.33,58.72 C11.2 35.76,65.63 36.27,66.14 36.27,78.49 37.18,79.4 61.09,79.4 66.25,84.56 75.03,84.56 76.2,83.39 76.2,81.81 76.84,81.18 78.64,81.18 B1.A5
A5IN
  Bottom 0.152: R30.1 28.25,43.69 27.53,42.98 21.61,42.98 20.55,41.92 20.55,14.94 24.13,11.35 40.12,11.35 40.69,11.92 J1.11
A6  (via drill 0.35)
  Top 0.152: B1.A6 v82.55,87.63
  Bottom 0.152: R31.2 3.51,56.72 6.09,59.31 C12.2 9.24,59.31 9.86,59.92 9.86,86.97 10.52,87.63 v82.55,87.63
A6IN
  Bottom 0.152: R31.1 3.51,42.67 4.04,42.14 16.89,42.14 17.48,41.55 17.48,13.65 25.62,5.51 59.38,5.51 60.19,6.31 J1.9
A7  (via drill 0.35)
  Top 0.152: B1.A7 v85.09,87.15
  Bottom 0.152: R32.2 6.05,57.58 6.66,58.19 10.46,58.19 11.12,58.85 C13.2 11.86,65.63 12.5,66.27 12.5,86.77 13.08,87.35 81.81,87.35 82.02,87.15 v85.09,87.15
A7IN
  Bottom 0.152: R32.1 6.05,43.03 6.66,42.42 17.01,42.42 17.76,41.67 17.76,13.77 25.73,5.79 57.96,5.79 58.69,6.51 J1.17
A8  (via drill 0.35)
  Top 0.152: B1.A8 v90.17,86.66
  Bottom 0.152: R33.2 7.93,57.43 8.41,57.91 10.58,57.91 11.95,59.28 C14.2 13.69,59.28 14.28,59.87 14.28,86.38 14.96,87.07 81.7,87.07 81.9,86.87 84.35,86.87 84.56,86.66 v90.17,86.66
A8IN
  Bottom 0.152: R33.1 7.93,43.28 8.51,42.7 17.12,42.7 18.03,41.79 18.03,13.88 25.85,6.07 56.39,6.07 57.19,6.87 J1.8
A9  (via drill 0.35)
  Top 0.152: v92.71,86.13 B1.A9
  Bottom 0.152: R34.2 10.46,57.38 11.28,58.19 14.96,58.19 15.54,58.78 C15.2 16.23,65.63 16.87,66.27 16.87,86.08 17.58,86.79 81.58,86.79 81.78,86.59 84.24,86.59 84.44,86.38 89.74,86.38 90,86.13 v92.71,86.13
A9IN
  Bottom 0.152: R34.1 10.46,43.51 11,42.98 17.24,42.98 18.31,41.9 18.31,14 25.96,6.35 54.84,6.35 55.69,7.2 J1.16
A10  (via drill 0.35)
  Top 0.152: B1.A10 v95.25,85.65
  Bottom 0.152: R35.2 12.4,57.43 12.88,57.91 15.66,57.91 17.03,59.28 C16.2 18.16,59.28 18.8,59.92 18.8,85.88 19.43,86.51 81.47,86.51 81.67,86.31 84.12,86.31 84.33,86.11 89.62,86.11 89.89,85.84 91.98,85.84 92.18,85.65 v95.25,85.65
A10IN
  Bottom 0.152: R35.1 12.4,43.79 12.93,43.26 17.35,43.26 18.59,42.02 18.59,14.12 26.08,6.63 53.47,6.63 54.19,7.35 J1.7
A11  (via drill 0.35)
  Top 0.152: B1.A11 v97.79,85.17
  Bottom 0.152: R36.2 14.94,56.77 16.33,58.17 19.48,58.17 20.02,58.7 C17.2 20.7,65.63 21.36,66.29 21.36,85.57 22.02,86.23 81.35,86.23 81.55,86.03 84.01,86.03 84.21,85.83 89.51,85.83 89.77,85.56 91.87,85.56 92.06,85.37 94.51,85.37 94.72,85.17 v97.79,85.17
A11IN
  Bottom 0.152: R36.1 14.94,44.12 15.52,43.54 17.47,43.54 18.87,42.13 18.87,14.23 26.2,6.91 50.42,6.91 51.19,7.68 J1.6
A12
  Bottom 0.152: R37.2 21.29,57.45 21.72,57.89 23.99,57.89 25.39,59.28 C18.2 27.12,59.28 27.69,59.84 27.69,84.81 28.27,85.4 81,85.4 81.21,85.19 83.66,85.19 83.86,84.99 89.16,84.99 89.42,84.73 91.52,84.73 91.71,84.53 94.17,84.53 94.37,84.33 96.82,84.33 97.03,84.12 100,84.12 100.33,83.79 B1.A12
A12IN
  Bottom 0.152: R37.1 21.29,43.84 19.71,42.27 19.71,14.58 26.54,7.75 46.08,7.75 46.69,8.36 J1.13
A13
  Bottom 0.152: R38.2 23.85,57.35 24.64,58.14 28.3,58.14 28.91,58.75 C19.2 29.61,65.63 30.23,66.24 30.23,78.49 36.86,85.12 80.89,85.12 81.09,84.91 83.54,84.91 83.75,84.71 89.04,84.71 89.31,84.45 91.4,84.45 91.6,84.25 94.05,84.25 94.25,84.05 96.71,84.05 96.91,83.84 98.5,83.84 99.06,83.29 99.06,81.71 99.59,81.18 101.5,81.18 B1.A13
A13IN
  Bottom 0.152: R38.1 23.85,44.14 23.24,43.54 21.38,43.54 19.99,42.15 19.99,14.7 26.67,8.03 44.6,8.03 45.19,8.61 J1.4
A14
  Bottom 0.152: R39.2 19.36,57.25 20.27,58.17 23.88,58.17 24.44,58.72 C20.2 25.17,65.63 25.76,66.22 25.76,84.99 26.44,85.67 81.12,85.67 81.32,85.47 83.78,85.47 83.98,85.27 89.28,85.27 89.54,85 91.64,85 91.83,84.81 94.28,84.81 94.48,84.61 96.94,84.61 97.14,84.4 105,84.4 105.41,84 B1.A14
A14IN
  Bottom 0.152: R39.1 19.43,52.86 19.43,14.46 26.43,7.47 47.47,7.47 48.19,8.18 J1.5
A15
  Bottom 0.152: R40.2 16.82,57.38 17.32,57.89 19.6,57.89 20.99,59.28 C21.2 22.63,59.28 23.22,59.87 23.22,85.32 23.85,85.95 81.23,85.95 81.44,85.75 83.89,85.75 84.09,85.55 89.39,85.55 89.65,85.28 91.75,85.28 91.94,85.09 94.4,85.09 94.6,84.89 97.05,84.89 97.26,84.68 107.42,84.68 107.95,84.15 B1.A15
A15IN
  Bottom 0.152: R40.1 16.82,44.6 19.15,42.27 19.15,14.35 26.31,7.19 48.92,7.19 49.69,7.95 J1.14
CALIB
  Bottom 0.152: R50.1 B1.13 45.47,27.58 46.2,26.85 50.65,26.85 51.19,26.31 J1.31
CAN_CS
  Bottom 0.152: B1.49 114.78,69.85 125.04,59.59 125.04,51.54 125.78,50.8 U4.D10
CANHI  (via drill 0.35)
  Top 0.152: JP1.3 147.4,44.45 142.24,44.45 131.9,34.11 v131.9,25.83 | v109.75,18.11 92.72,18.11 J1.60
  Bottom 0.152: v131.9,25.83 124.18,18.11 v109.75,18.11
CANLO  (via drill 0.35)
  Top 0.152: JP1.4 148.67,43.18 143.51,43.18 133.35,33.02 133.35,26.14 v133.33,26.11 | J1.53 109.74,15.58 v109.75,15.57
  Bottom 0.152: v109.75,15.57 122.78,15.57 v133.33,26.11
DIN  (via drill 0.35)
  Top 0.152: v197.43,54.61 197.43,56.79 Q1.2 v197.6,58.78 v197.59,58.78 | XB1.4 196.73,80.69 v196.72,80.7
  Bottom 0.152: v197.43,54.61 R3.1 | v197.59,58.78 197.59,65 196.85,65.73 193.09,65.73 192.46,66.37 192.46,80.19 192.96,80.7 v196.72,80.7
DOUT  (via drill 0.35)
  Top 0.152: v190.5,53.34 190.5,55.95 Q2.2 195.51,60.96 v196.85,60.96 | v197.99,81.33 197.99,77.99 XB1.3
  Bottom 0.152: v190.5,53.34 190.5,53.19 190.02,52.7 R1.1 | v196.85,60.96 196.85,64.62 196.01,65.46 192.97,65.46 192.18,66.25 192.18,80.3 193.2,81.33 v197.99,81.33
FL_WS
  Bottom 0.152: B1.2 74.93,43.54 74.04,44.42 59.26,44.42 R47.2 58.12,40.64 59.84,38.91 59.84,26.09 58.69,24.93 J1.25
FR_WS
  Bottom 0.152: B1.3 72.39,42.49 71.6,43.28 R48.2 62.53,41.25 60.19,38.9 60.19,37.22 60.19,36.83 J1.34
GND  (via drill 0.35)
  Top 0.152: IC1.4 v187.25,25.09 | U6.5 U6.4 v177.32,20.06 v177.32,20.07 | U7.5 U7.4 v191.8,20.06 v191.79,20.07 | v39.67,63.86 v35.26,63.86 v30.79,63.86 v26.37,63.86 v21.89,63.86 v17.48,63.86 v13.01,63.86 v8.59,63.86 8.59,69.75 9.04,70.21 v11.12,70.21 v15.54,70.21 v20.02,70.21 v24.44,70.21 v28.91,70.21 v33.33,70.21 v37.8,70.21 v42.22,70.21 | U1.2 v188.06,55.17 | XB1.32 200.48,62.46 200.79,62.15 v201.75,62.15 202.72,62.15 202.98,62.42 XB1.34 | XB1.21 186.73,62.22 v186.28,61.77 | XB1.12 186.73,80.2 187.12,80.59 v187.96,80.59 189,80.59 189.23,80.36 XB1.10 | XB1.1 v200.48,80.67 | U4.GND@2 127,40.64 v124.46,38.1
  Bottom 0.152: C12.1 v8.59,63.86 | v13.01,63.86 C14.1 | v17.48,63.86 C16.1 | v21.89,63.86 C21.1 | v26.37,63.86 C18.1 | v30.79,63.86 C10.1 | v35.26,63.86 C9.1 | v39.67,63.86 C7.1 | v11.12,70.21 C13.1 | v15.54,70.21 C15.1 | v20.02,70.21 C17.1 | v24.44,70.21 C20.1 | v28.91,70.21 C19.1 | v33.33,70.21 C11.1 | v37.8,70.21 C8.1 | v42.22,70.21 C6.1
  pour Bottom: 0,88.9 204.47,88.9 204.47,0 0,0
LCL  (via drill 0.35)
  Top 0.152: IC1.7 v198.2,27.63 | v95.25,10.08 J1.41
  Bottom 0.152: R10.1 v198.2,27.63 195.99,27.63 195.58,27.23 195.58,4.22 193.62,2.26 186.49,2.26 185.78,1.55 95.76,1.55 95.25,2.06 v95.25,10.08 | J1.41 J1.40 J1.39 J1.38 J1.37 J1.36 J1.35 74.69,11.08 J1.42 | J1.42 J1.43 J1.44 J1.45 J1.46 J1.47 | J1.57 83.69,17.39 83.11,16.81 80.95,16.81 79.72,15.58 J1.49 J1.48 76.2,15.57 J1.42
LDA  (via drill 0.35)
  Top 0.152: IC1.2 v187.25,27.63 | v186.69,11.94 v186.69,1.27 | J1.32 55.43,16.84 v63.78,16.84
  Bottom 0.152: v187.25,27.63 186.69,27.63 | 186.69,27.63 R9.2 | 186.69,27.63 v186.69,11.94 | v63.78,16.84 66.65,19.71 93.6,19.71 94.69,18.62 94.69,1.55 94.97,1.27 v186.69,1.27
MISO
  Bottom 0.152: B1.50 111.73,71.14 111.73,69.11 112.27,68.58 114.25,68.58 124.77,58.06 124.77,46.71 125.75,45.72 U4.D12
MOSI
  Bottom 0.152: B1.51 114.96,72.39 125.32,62.03 125.32,52.63 125.88,52.07 129.24,52.07 130,51.31 130,49.2 129.06,48.26 U4.D11
N$1  (via drill 0.35)
  Top 0.152: v158.12,12.39 158.69,12.97 INTAKEPRES.1
  Bottom 0.152: R16.1 v158.12,12.39
N$2  (via drill 0.35)
  Top 0.152: U1.3 189.01,55.1 188.47,54.56 v184.46,54.56
  Bottom 0.152: R6.2 R5.2 v184.46,54.56
N$3  (via drill 0.51)
  other vias: 14,19.69
N$4  (via drill 0.35)
  Top 0.152: v158.14,4.8 158.69,5.35 DASH.1
  Bottom 0.152: R11.1 v158.14,4.8
N$5  (via drill 0.35)
  Top 0.152: v147.98,12.39 148.55,12.97 INTAKETEMP.1
  Bottom 0.152: R17.1 v147.98,12.39
N$6  (via drill 0.35)
  Top 0.152: v137.82,12.42 138.37,12.97 COOLANTTEMP.1
  Bottom 0.152: R18.1 v137.82,12.42
N$7  (via drill 0.35)
  Top 0.152: v168.28,20.02 168.85,20.59 OILPRES.1
  Bottom 0.152: R19.1 v168.28,20.02
N$8  (via drill 0.35)
  Top 0.152: v158.09,20.02 158.66,20.59 OILTEMP.1
  Bottom 0.152: R20.1 v158.09,20.02
N$9  (via drill 0.35)
  Top 0.152: v147.93,20.02 148.5,20.59 SPARE1.1
  Bottom 0.152: R21.1 v147.93,20.02
N$10  (via drill 0.35)
  Top 0.152: v137.82,20.02 138.37,20.56 SPARE2.1
  Bottom 0.152: R22.1 v137.82,20.02
N$11  (via drill 0.35)
  Top 0.152: v153.06,25.09 153.63,25.67 DAQ.1
  Bottom 0.152: R23.1 v153.06,25.09
N$12  (via drill 0.35)
  Top 0.152: v177.16,4.77 178.51,6.12 REC.2
  Bottom 0.152: R24.2 v177.16,4.77
N$15  (via drill 0.35)
  Top 0.152: U6.14 188.46,20.71 v188.47,20.7
  Bottom 0.152: v188.47,20.7 R43.1
N$17  (via drill 0.35)
  Top 0.152: v168.3,4.8 168.85,5.35 LAMBDAS.1
  Bottom 0.152: R12.1 v168.3,4.8
N$18  (via drill 0.35)
  Top 0.152: v147.98,4.8 148.53,5.35 BRAKETEMP.1
  Bottom 0.152: R13.1 v147.98,4.8
N$19  (via drill 0.35)
  Top 0.152: v137.77,4.77 138.37,5.37 SHOCKPOT.1
  Bottom 0.152: R14.1 v137.77,4.77
N$20  (via drill 0.35)
  Top 0.152: v168.28,12.39 168.85,12.97 BRAKEPRES.1
  Bottom 0.152: R15.1 v168.28,12.39
N$24
  Bottom 0.152: R51.2 R59.1 R60.2
N$28  (via drill 0.35)
  Top 0.152: v199.24,80.7 XB1.2
  Bottom 0.152: C5.2 C4.2 C3.2 199.24,78.63 v199.24,80.7
N$31  (via drill 0.35)
  Top 0.152: v190.47,80.7 XB1.9
  Bottom 0.152: R8.2 v190.47,80.7
N$32
  Bottom 0.152: R53.2 R62.1 R63.2
N$33  (via drill 0.35)
  Top 0.152: v194.23,62.05 XB1.27
  Bottom 0.152: R7.1 190.47,62.38 190.81,62.05 v194.23,62.05
N$35  (via drill 0.35)
  Top 0.152: v199.09,14.83 199.09,20.19 199.6,20.71 U7.14
  Bottom 0.152: R46.1 200.15,15.9 v199.09,14.83
N$40
  Bottom 0.152: R55.2 R65.1 R66.2
N$42  (via drill 0.35)
  Top 0.152: U6.9 v185.58,15.4 v185.57,15.39
  Bottom 0.152: v185.57,15.39 R41.2
N$43  (via drill 0.35)
  Top 0.152: v177.32,17.47 179.66,17.47 U6.8
  Bottom 0.152: R42.2 182.17,16.89 181.59,17.47 v177.32,17.47
N$44  (via drill 0.35)
  Top 0.152: U7.9 200.66,17.41 v200.66,14.83
  Bottom 0.152: v200.66,14.83 R44.2
N$45  (via drill 0.35)
  Top 0.152: v194.72,14.83 v194.71,14.84 U7.8
  Bottom 0.152: R45.2 194.69,14.86 v194.72,14.83
N$47
  Bottom 0.152: R57.2 R68.1 R69.2
REC  (via drill 0.35)
  Top 0.152: REC.1 181.71,1.22 181.18,0.69 127.11,0.69 122.48,5.32 122.48,18.69 112.76,28.41 v57.15,28.41 56.43,28.41 B1.11
  Bottom 0.152: R49.2 B1.11 | J1.33 57.15,18.12 v57.15,28.41
RX0  (via drill 0.35)
  Top 0.152: Q2.3 v194.34,53.36 194.34,50.27 193.27,49.2 189.51,49.2 187.91,50.8 167.54,50.8 v166.98,50.24
  Bottom 0.152: B1.0 86.36,40.64 125.02,40.64 126.21,39.45 132.02,39.45 140.81,48.23 165.86,48.23 166.98,49.35 v166.98,50.24 | v194.34,53.36 193.68,52.7 R2.1
SCK
  Bottom 0.152: B1.52 111.76,76.2 115.21,76.2 125.88,65.53 125.88,58.47 126.64,57.71 130,57.71 130.81,56.9 130.81,43.84 130.15,43.18 U4.D13
SCL  (via drill 0.35)
  Top 0.152: IC1.6 193.78,26.36 193.45,26.03 193.45,24.59 | U6.16 184.79,22.8 v184.79,23.97 v184.79,23.98 192.84,23.98 193.45,24.59 | U6.2 v177.32,21.36 177.32,27.69 176.43,28.58 v154.66,28.58 | 193.45,24.59 193.45,22.4 193.84,22.01 U7.1 U7.16
  Bottom 0.152: v184.79,23.97 177.87,23.97 177.32,23.42 v177.32,21.36 | B1.21 104.8,36.22 109.17,36.22 109.83,35.56 114.3,35.56 115.37,34.49 115.37,29.95 116.33,28.98 154.25,28.98 v154.66,28.58
SD_CS
  Bottom 0.152: B1.53 115.39,74.93 125.6,64.72 125.6,54.15 126.42,53.34 U4.D9
SDA  (via drill 0.35)
  Top 0.152: 184.15,26.36 IC1.3 v192.3,26.36 | 184.15,26.36 180.31,26.36 179.68,25.73 | 179.68,25.73 U6.1 | 184.15,26.36 184.15,21.77 184.56,21.36 U6.15 | v191.82,21.36 U7.2 U7.15 | v191.82,21.36 | v156.77,29.59 175.81,29.59 179.68,25.73
  Bottom 0.152: v191.82,21.36 191.82,25.88 v192.3,26.36 | B1.20 104.14,38.1 114.3,38.1 115.65,36.75 115.65,30.06 116.45,29.26 156.44,29.26 v156.77,29.59
SG_11  (via drill 0.35)
  Top 0.152: J1.30 48.19,25.2 48.64,25.65 v111.76,25.65 | v142.57,26.59 142.57,38.51 v145.14,41.07
  Bottom 0.152: R70.2 R58.2 v145.14,41.07 | v111.76,25.65 130.49,25.65 131.43,26.59 v142.57,26.59
SG_21  (via drill 0.35)
  Top 0.152: J1.29 45.19,25.93 45.7,26.44 v111.76,26.44 | v145.14,26.69 v145.14,33.5
  Bottom 0.152: R67.2 R56.2 v145.14,33.5 | v111.76,26.44 130.88,26.44 131.52,27.08 144.75,27.08 v145.14,26.69
SG_31  (via drill 0.35)
  Top 0.152: J1.28 42.19,26.59 42.8,27.2 v111.76,27.2 | v152.68,27.43 158.75,33.5 v159.23,33.5
  Bottom 0.152: R64.2 R54.2 v159.23,33.5 | v111.76,27.2 131.25,27.2 131.48,27.43 v152.68,27.43
SG_41  (via drill 0.35)
  Top 0.152: J1.27 39.19,27.2 39.93,27.94 v111.76,27.94 | v151.18,27.94 151.18,33.07 v159.23,41.12
  Bottom 0.152: R61.2 R52.2 v159.23,41.12 | v111.76,27.94 v151.18,27.94
TX0  (via drill 0.35)
  Top 0.152: v203.5,54.63 202.43,54.63 Q1.3 200.38,49.63 199.01,48.26 174.52,48.26 173.89,48.89 v165.25,48.89
  Bottom 0.152: B1.1 86.36,43.18 125.15,43.18 126.39,41.94 134.11,41.94 141.07,48.89 v165.25,48.89 | v203.5,54.63 203.5,53.16 203.02,52.68 201.52,52.68 R4.1
(copper drawn outside any net)
  shapes: Top area x2

## Text on the board
tPlace: 3.3V | 12V | GND | 5V
bPlace: Northwestern Formula Racing | Data Acquisition | Alex Kang, Jack Burkhardt | 2021-2022
tNames: CAN-BUS shield
Measures: Units: inches
tDocu: A. Weiss | Revised by: Patrick Alberts